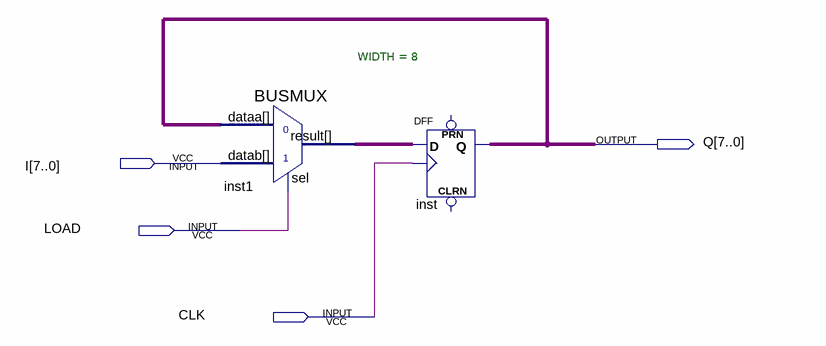
[diagram p0: schematic sheet]
// Quartus schematic RE.bdf as structural Verilog: 2 symbols, 4 pins
module RE (
  input  [7:0] I,
  input  LOAD,
  input  CLK,
  output [7:0] Q
);

  wire [7:0] inst1_result;

  BUSMUX #(.WIDTH(8)) inst1 (.datab(I), .sel(LOAD), .dataa(Q), .result(inst1_result));
  DFF inst[7:0] (.CLK(CLK), .D(inst1_result), .Q(Q));  // open: CLRN, PRN
endmodule
